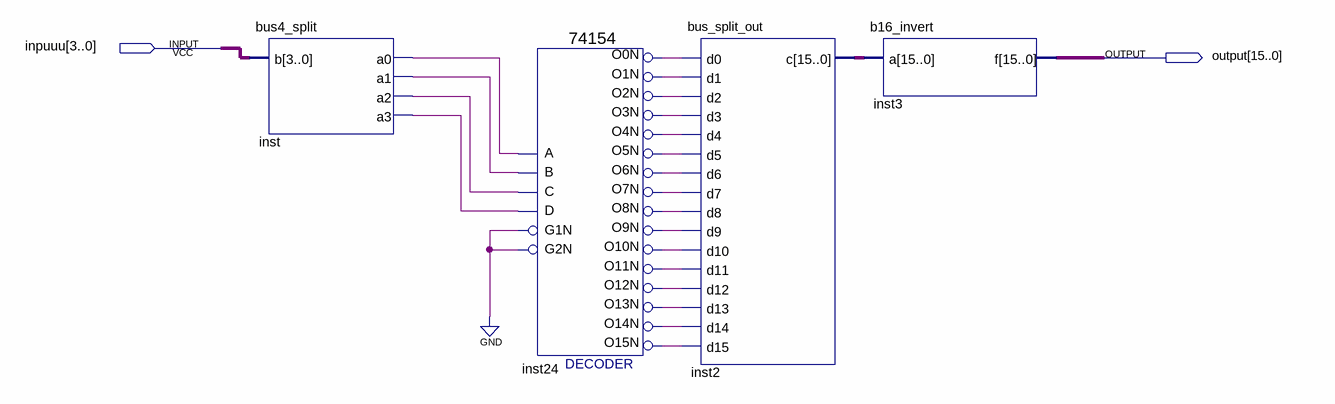
[diagram p0: schematic sheet]
// Quartus schematic busified_16decoder.bdf as structural Verilog: 4 symbols, 2 pins
module busified_16decoder (
  input  [3:0] inpuuu,
  output [15:0] \output 
);

  wire inst24_o0n, inst24_o1n, inst24_o2n, inst24_o3n, inst24_o4n, inst24_o5n, inst24_o6n, inst24_o7n,
       inst24_o8n, inst24_o9n, inst24_o10n, inst24_o11n, inst24_o12n, inst24_o13n, inst24_o14n, inst24_o15n,
       inst_a0, inst_a1, inst_a2, inst_a3;
  wire [15:0] inst2_c;

  bus4_split inst (.b(inpuuu), .a0(inst_a0), .a1(inst_a1), .a2(inst_a2), .a3(inst_a3));
  \74154  inst24 (
    .C(inst_a2), .D(inst_a3), .B(inst_a1), .A(inst_a0), .G1N(1'b0), .G2N(1'b0), .O0N(inst24_o0n),
    .O12N(inst24_o12n), .O15N(inst24_o15n), .O10N(inst24_o10n), .O11N(inst24_o11n), .O1N(inst24_o1n),
    .O13N(inst24_o13n), .O14N(inst24_o14n), .O4N(inst24_o4n), .O3N(inst24_o3n), .O2N(inst24_o2n),
    .O7N(inst24_o7n), .O6N(inst24_o6n), .O5N(inst24_o5n), .O9N(inst24_o9n), .O8N(inst24_o8n));
  bus_split_out inst2 (
    .d0(inst24_o0n), .d1(inst24_o1n), .d2(inst24_o2n), .d3(inst24_o3n), .d4(inst24_o4n), .d5(inst24_o5n),
    .d6(inst24_o6n), .d7(inst24_o7n), .d8(inst24_o8n), .d9(inst24_o9n), .d10(inst24_o10n), .d11(inst24_o11n),
    .d12(inst24_o12n), .d13(inst24_o13n), .d14(inst24_o14n), .d15(inst24_o15n), .c(inst2_c));
  b16_invert inst3 (.a(inst2_c), .f(\output ));
endmodule
